# Altium schematic sheet 07 - CONNECTOR_CSKB.SchDoc
size A4; SheetNumber: 7; SheetTotal: 7
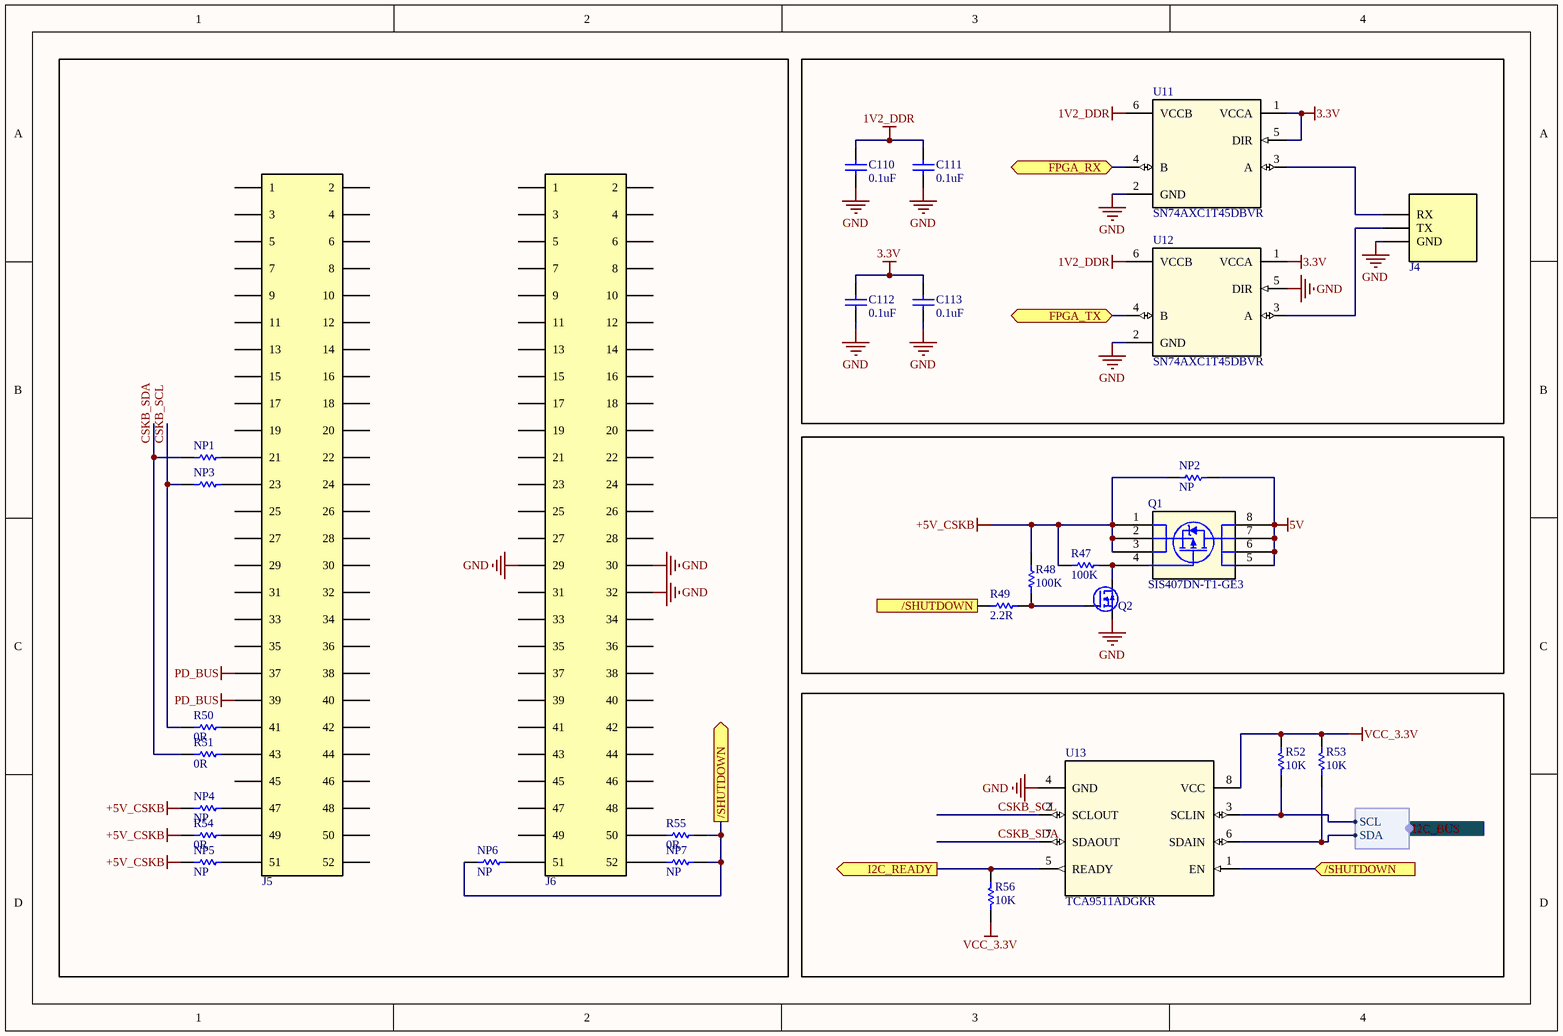
[diagram p0: 07 - CONNECTOR_CSKB.SchDoc]

## Parts
C110  value 0.1uF  [0402-C-R]  (hidden comment: GRM155R61E104KA87D)
C111  value 0.1uF  [0402-C-R]  (hidden comment: GRM155R61E104KA87D)
C112  value 0.1uF  [0402-C-R]  (hidden comment: GRM155R61E104KA87D)
C113  value 0.1uF  [0402-C-R]  (hidden comment: GRM155R61E104KA87D)
J4  CONN PTH 3PIN  [CONNECTOR BATTERY]  (value not drawn)
J5  ESQ-126-39-G-D  [SAMTEC_ESQ-126-39-G-D]  (value not drawn)
J6  ESQ-126-39-G-D  [SAMTEC_ESQ-126-39-G-D]  (value not drawn)
NP1  NP  [0402-R-NP]  (value not drawn)
NP2  NP  [0402-R-NP]
NP3  NP  [0402-R-NP]  (value not drawn)
NP4  NP  [0402-R-NP]
NP5  NP  [0402-R-NP]
NP6  NP  [0402-R-NP]
NP7  NP  [0402-R-NP]
Q1  SIS407DN-T1-GE3  [SIS413DN-T1-GE3_VIS]
Q2  IRF8010PBF  [SC70-6L_VIS]  (value not drawn)
R47  value 100K  [0402-R-R]  (hidden comment: RMCF0402FT100K)
R48  value 100K  [0402-R-R]  (hidden comment: RMCF0402FT100K)
R49  value 2.2R  [0402-R-R]  (hidden comment: RC0402FR-072R2L)
R50  value 0R  [0402-R-R]  (hidden comment: RMCF0402ZT0R00)
R51  value 0R  [0402-R-R]  (hidden comment: RMCF0402ZT0R00)
R52  value 10K  [0402-R-R]  (hidden comment: RMCF0402FT10K0)
R53  value 10K  [0402-R-R]  (hidden comment: RMCF0402FT10K0)
R54  value 0R  [0402-R-R]  (hidden comment: RMCF0402ZT0R00)
R55  value 0R  [0402-R-R]  (hidden comment: RMCF0402ZT0R00)
R56  value 10K  [0402-R-R]  (hidden comment: RMCF0402FT10K0)
U11  SN74AXC1T45DBVR  [SN74AXC1T45DBVR]
U12  SN74AXC1T45DBVR  [SN74AXC1T45DBVR]
U13  TCA9511ADGKR  [DGK0008A_L]

## Ports
/SHUTDOWN (in), /SHUTDOWN (out), FPGA_RX (bidir), FPGA_TX (bidir), I2C_BUS (harness I2C), I2C_READY (out)

## Harnesses
I2C: SCL, SDA

## Nets
1V2_DDR: C110.2 C111.2 U11.6(VCCB) U12.6(VCCB)
3.3V: C112.2 C113.2 U11.1(VCCA) U11.5(DIR) U12.1(VCCA)
5V: NP2.2 Q1.5(D) Q1.6(D) Q1.7(D) Q1.8(D)
+5V_CSKB: NP2.1 NP4.1 NP5.1 Q1.1(S) Q1.2(S) Q1.3(S) R47.2 R48.2 R54.1
GND: C110.1 C111.1 C112.1 C113.1 J4.1(GND) J6.29 J6.30 J6.32 Q2.4,7(S) U11.2(GND) U12.2(GND) U12.5(DIR) U13.4(GND)
PD_BUS: J5.37 J5.39
VCC_3.3V: R52.2 R53.2 R56.1 U13.8(VCC)
/SHUTDOWN: NP6.1 NP7.2 R49.1 R55.2 U13.1(EN) ; port /SHUTDOWN
CSKB_SCL: NP3.1 R50.1 U13.2(SCLOUT)
CSKB_SDA: NP1.1 R51.1 U13.7(SDAOUT)
FPGA_RX: U11.4(B) ; port FPGA_RX
FPGA_TX: U12.4(B) ; port FPGA_TX
I2C_READY: R56.2 U13.5(READY) ; port I2C_READY
NetJ4_2: J4.2(TX) U12.3(A)
NetJ4_3: J4.3(RX) U11.3(A)
NetJ5_21: J5.21 NP1.2
NetJ5_23: J5.23 NP3.2
NetJ5_41: J5.41 R50.2
NetJ5_43: J5.43 R51.2
NetJ5_47: J5.47 NP4.2
NetJ5_49: J5.49 R54.2
NetJ5_51: J5.51 NP5.2
NetJ6_50: J6.50 R55.1
NetJ6_51: J6.51 NP6.2
NetJ6_52: J6.52 NP7.1
NetQ1_4: Q1.4(G) Q2.1,2,5,6(D) R47.1
NetQ2_3: Q2.3(G) R48.1 R49.2
NetR52_1: R52.1 U13.3(SCLIN) ; port I2C_BUS.SCL
NetR53_1: R53.1 U13.6(SDAIN) ; port I2C_BUS.SDA

Not connected (* = marked no-connect by the designer): J5 01(1) 02(2) 03(3) 04(4) 05(5) 06(6) 07(7) 08(8) 09(9) 10 11 12 13 14 15 16 17 18 19 20 22 24 25 26 27 28 29 30 31 32 33 34 35 36 38 40 42 44 45 46 48 50 52; J6 01(1) 02(2) 03(3) 04(4) 05(5) 06(6) 07(7) 08(8) 09(9) 10 11 12 13 14 15 16 17 18 19 20 21 22 23 24 25 26 27 28 31 33 34 35 36 37 38 39 40 41 42 43 44 45 46 47 48 49

## Library data of the parts
C110-C113 = CAP CER 0.1UF 25V X5R 0402: 0.1 µF ±10% 25V Ceramic Capacitor X5R 0402 (1005 Metric); SIZE: 0402; PN: GRM155R61E104KA87D; VOLTAGE: 25V; TOLERANCE: 10%
J5 J6 = CONN SOCKET 52POS 0.1 GOLD PCB: CONN SOCKET 52POS 0.1 GOLD PCB PN: ESQ-126-39-G-D; MF: Samtec; Package: None; PN: ESQ-126-39-G-D; Value: *; Availability: Unavailable; Price: None; SnapEDA_Link: https://www.snapeda.com/parts/ESQ-126-39-G-D/Samtec%20Inc./view-part/490181/?ref=snap
NP1-NP7 = RES SMD 0402 NP: PACK: 0402; VALUE: NP
Q1 = MOSFET P-CH 20V 9.5mOhm  25A: MOSFET P-CH 20V 25A 9.5mOhm PPAK1212-8 PN: SIS407DN-T1-GE3; Mfr_Name: Vishay; RefDes: RefDes; Type: Type; PN: SIS407DN-T1-GE3
Q2 = MOSFET N-CH 8V 12A PPAK SC70-6: MOSFET N-CH 8V 12A PPAK SC70-6 PN: SIA436DJ-T1-GE3; ID: 5714; CÓDIGO: 1003180105; PN: SIA436DJ-T1-GE3
R47 R48 = RES SMD 0402 100K 0.063W ±1%: RES SMD GERAL FILM 100K 0.063W ±1% 0402 7" TAPE PN: RMCF0402FT100K; PACK: 0402; POWER: 0.063W; TOLERANCE: 1%; PN: RMCF0402FT100K
R49 = RES SMD 0402 2.2R 0.063W ±1%: RES SMD GERAL FILM 2.2R 0.063W ±1% 0402 7" TAPE PN: RC0402FR-072R2L; PACK: 0402; POWER: 0.063W; TOLERANCE: 1%; PN: RC0402FR-072R2L
R50 R51 R54 R55 = RES SMD 0402 0R 0.063W ±1%: RES SMD GERAL FILM 0R 0.063W ±1% 0402 7" TAPE PN: RMCF0402ZT0R00 STACKPOLE; PACK: 0402; TOLERANCE: 1%; POWER: 0.063W; PN: RMCF0402ZT0R00
R52 R53 R56 = RES SMD 0402 10K 0.063W ±1%: RES SMD GERAL FILM 10K 0.063W ±1% 0402 7" TAPE PN: RMCF0402FT10K0 STACKPOLE; PACK: 0402; POWER: 0.063W; TOLERANCE: 1%; PN: RMCF0402FT10K0
U11 U12 = IC TRANSLATOR BIDIR SOT23-6: Nível de tensão Tradutor Bidirecional 1 Circuito 1 Canal 500Mbps SOT-23-6. PN: SN74AXC1T45DBVR; MF: Texas Instruments; SnapEDA_Link: https://www.snapeda.com/parts/SN74AXC1T45DBVR/Texas+Instruments/view-part/?ref=snap; Availability: In Stock; MP: SN74AXC1T45DBVR; Price: None; Purchase-URL: https://pricing.snapeda.com/search/part/SN74AXC1T45DBVR/?ref=eda; Check_prices: https://www.snapeda.com/parts/SN74AXC1T45DBVR/Texas+Instruments/view-part/?ref=eda; Package: SOT-23-6 Texas Instruments; Parameter 1: *; Value: *; PN: SN74AXC1T45DBVR
U13 = IC BUFFET I2C 1 CHANNEL 8-VSSOP: Buffer, Accelerator 1 Channel 8-VSSOP PN: TCA9511ADGKR; Manufacturer_Name: Texas Instruments; CompType: IC; TYPE: TYPE; RefDes: RefDes; Copyright: Copyright (C) 2025 Ultra Librarian. All rights reserved.; Manufacturer_Part_Number: TCA9511ADGKR; Datasheet: https://www.ti.com/lit/gpn/tca9511a; PN: TCA9511ADGKR; PackageReference: DGK0008A; MountType: SMT; Manufacturer: Texas Instruments